# EAGLE design Automaton_no_switches (EAGLE 6.1)
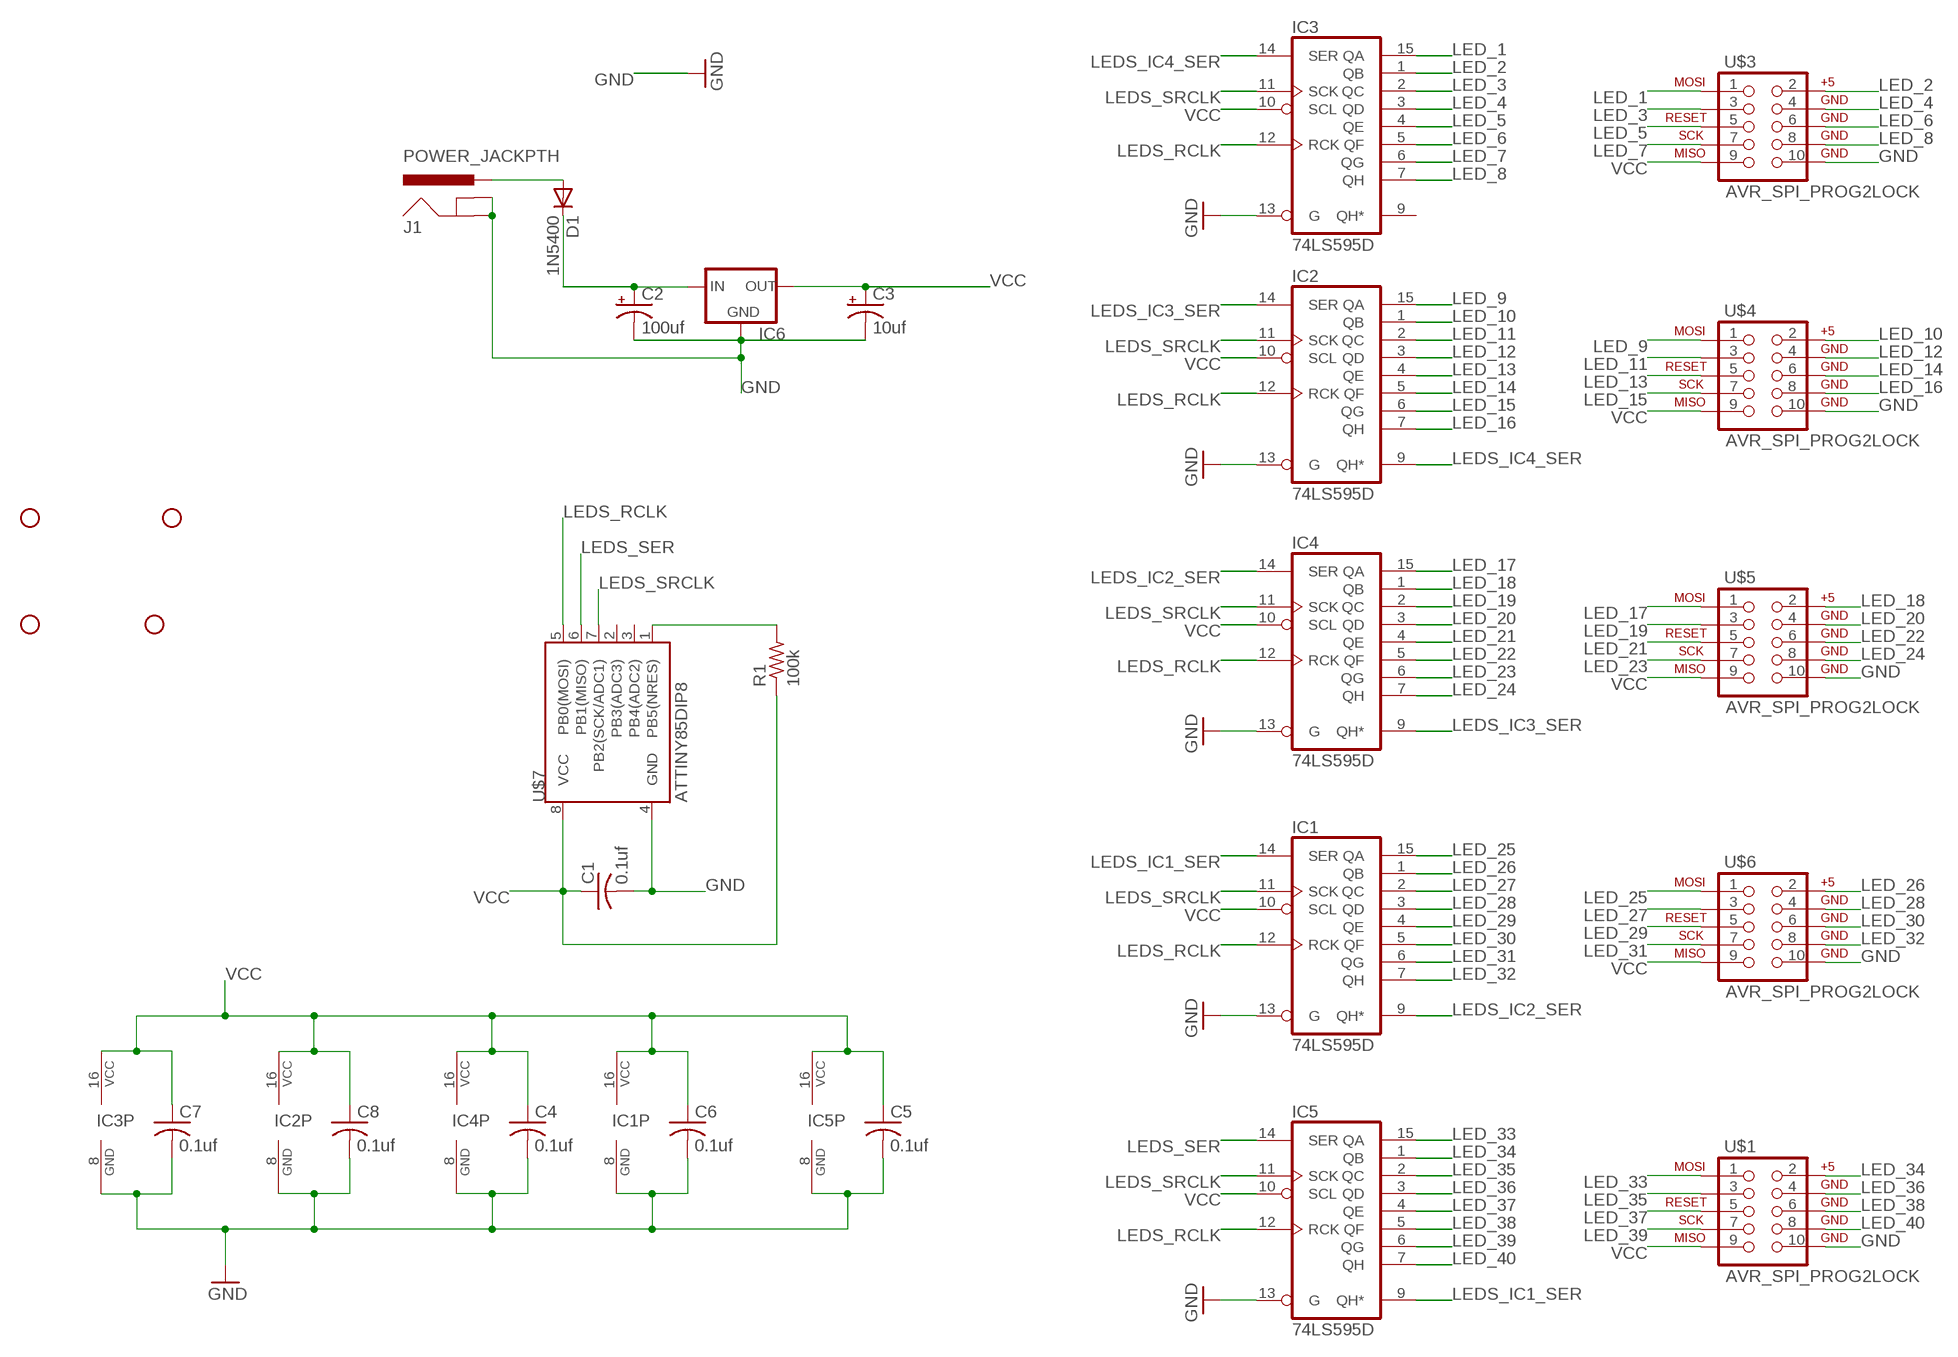
[diagram p0: schematic, sheet 1]

## Parts
C1  0.1uf  C-USC1206  [C1206]
C2  100uf  CPOL-USE5-10.5  [E5-10,5]
C3  10uf  CPOL-USE2-5  [E2-5]
C4  0.1uf  C-USC1206  [C1206]
C5  0.1uf  C-USC1206  [C1206]
C6  0.1uf  C-USC1206  [C1206]
C7  0.1uf  C-USC1206  [C1206]
C8  0.1uf  C-USC1206  [C1206]
D1  1N5400  [DO201-15]
IC1  74LS595D  [SO16]
IC2  74LS595D  [SO16]
IC3  74LS595D  [SO16]
IC4  74LS595D  [SO16]
IC5  74LS595D  [SO16]
IC6  V_REG_78XXSINK  [TO220-IGO]
J1  POWER_JACKPTH  [POWER_JACK_PTH]
JP1  STAND-OFF  [STAND-OFF]
JP2  STAND-OFF  [STAND-OFF]
JP3  STAND-OFF  [STAND-OFF]
JP4  STAND-OFF  [STAND-OFF]
R1  100k  R-US_M1206  [M1206]
U$1  AVR_SPI_PROG2LOCK  [2X5-SHROUDED_LOCK]
U$3  AVR_SPI_PROG2LOCK  [2X5-SHROUDED_LOCK]
U$4  AVR_SPI_PROG2LOCK  [2X5-SHROUDED_LOCK]
U$5  AVR_SPI_PROG2LOCK  [2X5-SHROUDED_LOCK]
U$6  AVR_SPI_PROG2LOCK  [2X5-SHROUDED_LOCK]
U$7  ATTINY85DIP8  [DIP08]

## Nets
GND: C1.2 C2.- C3.- C4.2 C5.2 C6.2 C7.2 C8.2 IC1.8(GND) IC1.13(G) IC2.8(GND) IC2.13(G) IC3.8(GND) IC3.13(G) IC4.8(GND) IC4.13(G) IC5.8(GND) IC5.13(G) IC6.GND J1.GND J1.GNDBREAK U$1.10 U$3.10 U$4.10 U$5.10 U$6.10 U$7.4(GND)
LED_1: IC3.15(QA) U$3.1
LED_2: IC3.1(QB) U$3.2
LED_3: IC3.2(QC) U$3.3
LED_4: IC3.3(QD) U$3.4
LED_5: IC3.4(QE) U$3.5
LED_6: IC3.5(QF) U$3.6
LED_7: IC3.6(QG) U$3.7
LED_8: IC3.7(QH) U$3.8
LED_9: IC2.15(QA) U$4.1
LED_10: IC2.1(QB) U$4.2
LED_11: IC2.2(QC) U$4.3
LED_12: IC2.3(QD) U$4.4
LED_13: IC2.4(QE) U$4.5
LED_14: IC2.5(QF) U$4.6
LED_15: IC2.6(QG) U$4.7
LED_16: IC2.7(QH) U$4.8
LED_17: IC4.15(QA) U$5.1
LED_18: IC4.1(QB) U$5.2
LED_19: IC4.2(QC) U$5.3
LED_20: IC4.3(QD) U$5.4
LED_21: IC4.4(QE) U$5.5
LED_22: IC4.5(QF) U$5.6
LED_23: IC4.6(QG) U$5.7
LED_24: IC4.7(QH) U$5.8
LED_25: IC1.15(QA) U$6.1
LED_26: IC1.1(QB) U$6.2
LED_27: IC1.2(QC) U$6.3
LED_28: IC1.3(QD) U$6.4
LED_29: IC1.4(QE) U$6.5
LED_30: IC1.5(QF) U$6.6
LED_31: IC1.6(QG) U$6.7
LED_32: IC1.7(QH) U$6.8
LED_33: IC5.15(QA) U$1.1
LED_34: IC5.1(QB) U$1.2
LED_35: IC5.2(QC) U$1.3
LED_36: IC5.3(QD) U$1.4
LED_37: IC5.4(QE) U$1.5
LED_38: IC5.5(QF) U$1.6
LED_39: IC5.6(QG) U$1.7
LED_40: IC5.7(QH) U$1.8
LEDS_IC1_SER: IC1.14(SER) IC5.9(QH*)
LEDS_IC2_SER: IC1.9(QH*) IC4.14(SER)
LEDS_IC3_SER: IC2.14(SER) IC4.9(QH*)
LEDS_IC4_SER: IC2.9(QH*) IC3.14(SER)
LEDS_RCLK: IC1.12(RCK) IC2.12(RCK) IC3.12(RCK) IC4.12(RCK) IC5.12(RCK) U$7.5(PB0(MOSI))
LEDS_SER: IC5.14(SER) U$7.6(PB1(MISO))
LEDS_SRCLK: IC1.11(SCK) IC2.11(SCK) IC3.11(SCK) IC4.11(SCK) IC5.11(SCK) U$7.7(PB2(SCK/ADC1))
N$1: C2.+ D1.C IC6.IN
N$2: R1.2 U$7.1(PB5(NRES))
N$3: D1.A J1.PWR
VCC: C1.1 C3.+ C4.1 C5.1 C6.1 C7.1 C8.1 IC1.10(SCL) IC1.16(VCC) IC2.10(SCL) IC2.16(VCC) IC3.10(SCL) IC3.16(VCC) IC4.10(SCL) IC4.16(VCC) IC5.10(SCL) IC5.16(VCC) IC6.OUT R1.1 U$1.9 U$3.9 U$4.9 U$5.9 U$6.9 U$7.8(VCC)
Unconnected: IC3.9(QH*) U$7.2(PB3(ADC3)) U$7.3(PB4(ADC2))

## Library data of the parts
C1 C4-C8 = resistor:C-US: CAPACITOR, American symbol
C2 C3 = rcl:CPOL-US: POLARIZED CAPACITOR, American symbol
D1 = diode:1N5400: DIODE standard rectifier, 3 A, 50 V (Motorola)
IC1-IC5 = 74xx-us:74*595: 8-bit SHIFT REGISTER, output latch
IC6 = SparkFun-PowerIC:V_REG_78XX: Voltage Regulator Standard 7805 5V regulator. IGO (Input Ground Output). Spark Fun Electronics SKU : COM-00107
J1 = SparkFun:POWER_JACK: Power Jack This is the standard 5.5mm barrel jack for power. The PTH is the most common, proven, reliable, footprint. All others are experimental. The Slot footprint only works if the mill layer is transmitted to the PCB fab house so be warned. Spark Fun Electronics SKU : PRT-00119. Mating wall wart : TOL-00298 (and others)
JP1-JP4 = SparkFun-Electromechanical:STAND-OFF: #4 Stand Off This is the mechanical footprint for a #4 phillips button head screw. Use the keepout ring to avoid running the screw head into surrounding components. SKU : PRT-00447
R1 = resistor:R-US_: RESISTOR, American symbol
U$1 U$3-U$6 = SparkFun:AVR_SPI_PROG2: AVR ICSP Header This is the standard AVR In Circuit Serial Programming header. Minimal, but includes pin one indicator. Works with standard Olimex programmers. Also look for the 6-pin reduced version. Spark Fun Electronics SKU: PRT-00778
U$7 = *Personal Library:ATTINY85: Atmel 8-pin 2/4/8kB flash uC

## Board
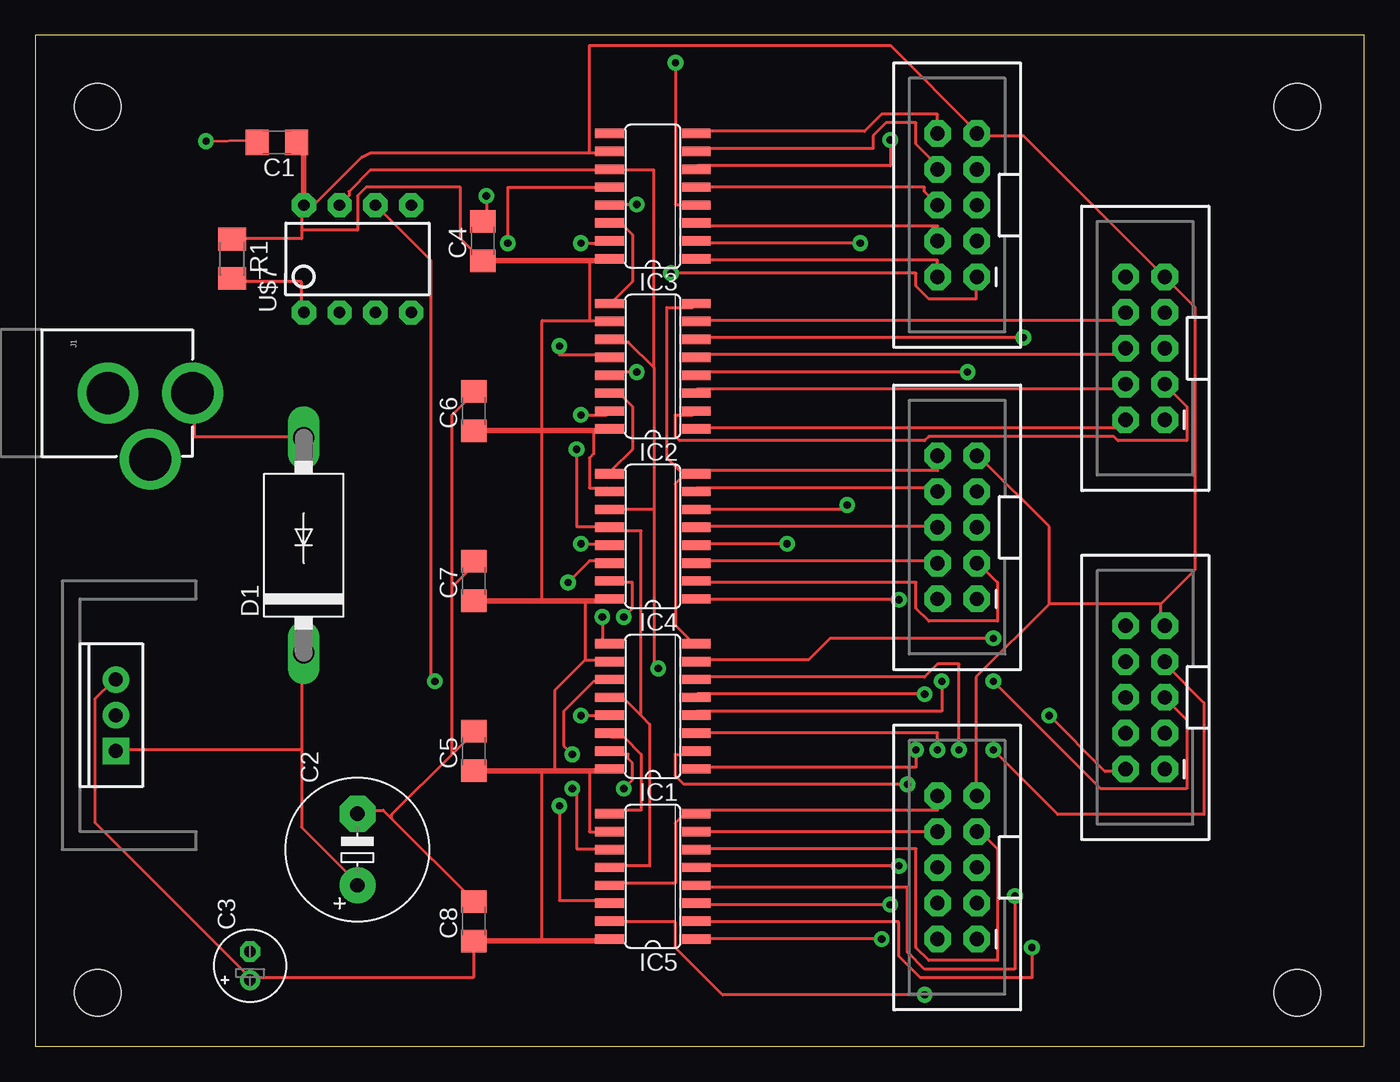
[diagram p1: board, top side]
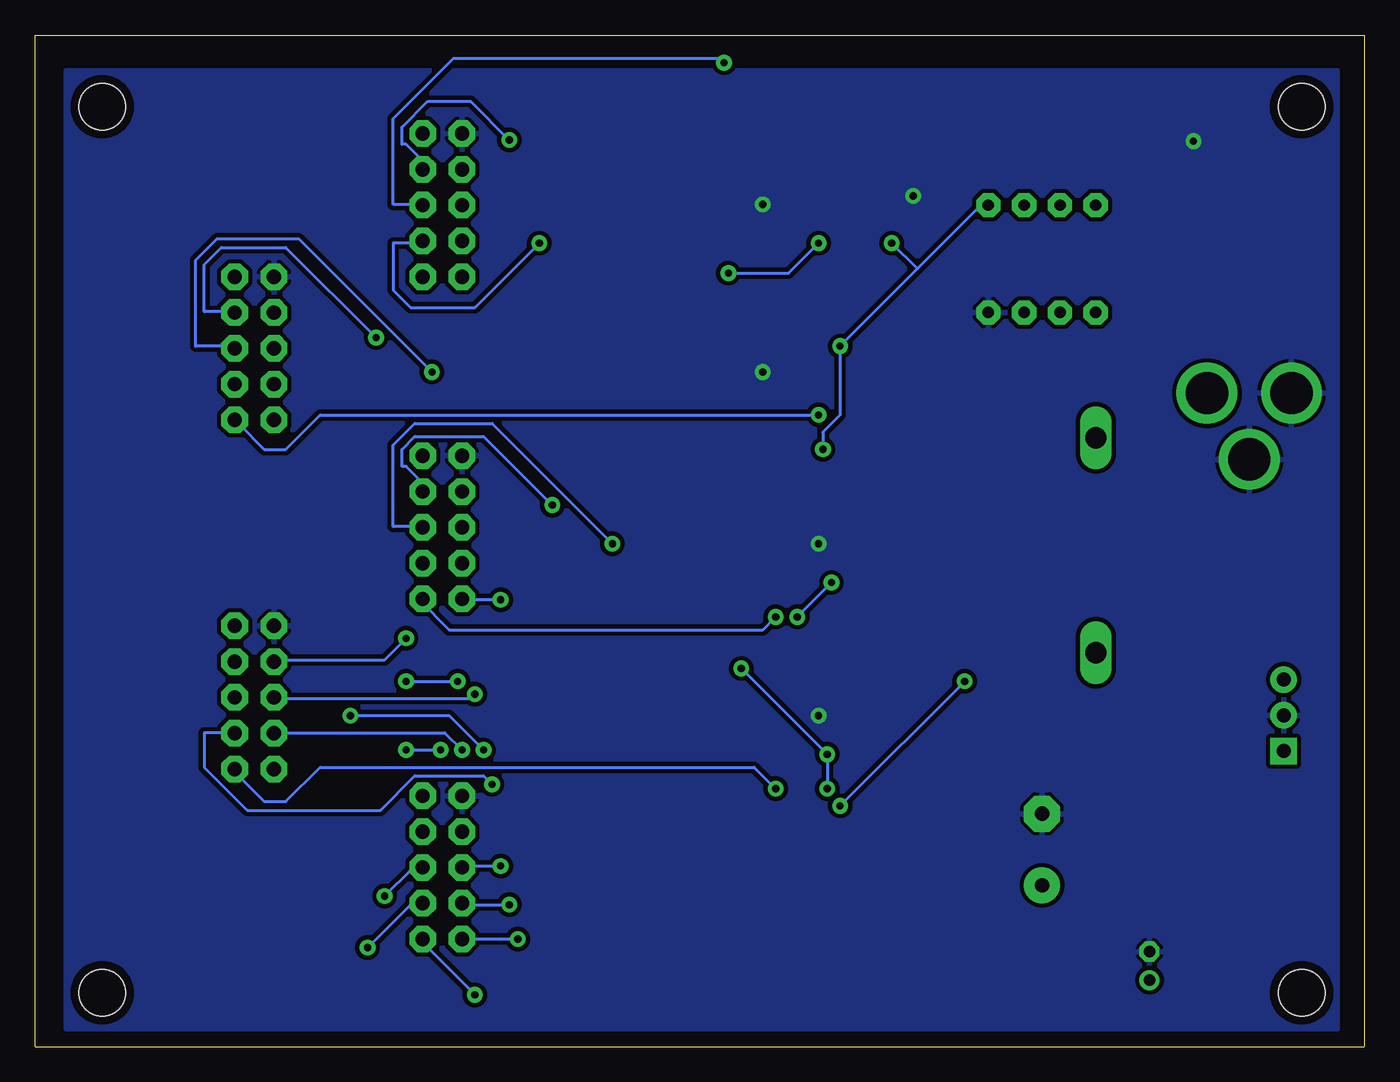
[diagram p2: board, bottom side, seen from below]

Size 94.28 x 71.76 mm. Coordinates in mm from the lower left corner, seen from the top.
Outline: 94.28,0.01 94.28,71.76 0,71.76 0,0.01
Outline: 94.28,0 0,0
Copper layers (1*16): Top 0.035mm / dielectric 1.5mm / Bottom 0.035mm
Design rules: minimum track width 8mil, minimum drill 20mil, track to track 12mil, track to pad 12mil, pad to pad 12mil, via to via 12mil, smd to smd 10mil, copper to edge 12mil, drill to drill 12mil, minimum pad ring 12mil, minimum via ring 12mil, stop-mask expansion 4mil, vias tented up to drill 25mil, thermal gap 10mil

### Footprints (pad centres in the part's own frame; a part is rotated, then mirrored left to right if it is on the bottom)
C1206 = smd 1.6 x 1.8: 1 -1.4,0; 2 1.4,0
E5-10,5 = drill 1.016 pad 2.54: + -2.54,0 | drill 1.016 pad 2.54 octagon: - 2.54,0
E2-5 = drill 0.813 pad 1.27: + -1.016,0 | drill 0.813 pad 1.27 octagon: - 1.016,0
DO201-15 = drill 1.499 long: A 7.62,0; C -7.62,0
SO16 = smd 0.66 x 2.032: 1 -4.445,-3.073; 2 -3.175,-3.073; 3 -1.905,-3.073; 4 -0.635,-3.073; 5 0.635,-3.073; 6 1.905,-3.073; 7 3.175,-3.073; 8 4.445,-3.073; 9 4.445,3.073; 10 3.175,3.073; 11 1.905,3.073; 12 0.635,3.073; 13 -0.635,3.073; 14 -1.905,3.073; 15 -3.175,3.073; 16 -4.445,3.073
TO220-IGO = drill 1 pad 1.88: GND 0,0; OUT 2.54,0 | drill 1 pad 1.88 square: IN -2.54,0
POWER_JACK_PTH = drill 2.997 pad 4.318: GND 0,7.7; GNDBREAK 4.7,10.7; PWR 0,13.7
STAND-OFF = hole 3.302: 0,0
M1206 = smd 1.6 x 2: 1 -1.4,0; 2 1.4,0
2X5-SHROUDED_LOCK = drill 1.016 pad 1.88 octagon: 1 -1.397,5.08; 2 1.397,5.08; 3 -1.397,2.54; 4 1.397,2.54; 5 -1.397,0; 6 1.397,0; 7 -1.397,-2.54; 8 1.397,-2.54; 9 -1.397,-5.08; 10 1.397,-5.08
DIP08 = drill 0.813 pad 1.727 octagon: 1 -3.81,-3.81; 2 -1.27,-3.81; 3 1.27,-3.81; 4 3.81,-3.81; 5 3.81,3.81; 6 1.27,3.81; 7 -1.27,3.81; 8 -3.81,3.81

### Placement (x,y rotation side)
C1  17.14,64.15 180 top
C2  22.86,13.98 90 top
C3  15.24,5.72 90 top
C4  31.75,57.16 90 top
C5  31.11,20.96 90 top
C6  31.11,45.09 90 top
C7  31.11,33.03 90 top
C8  31.11,8.9 90 top
D1  19.05,35.57 90 top
IC1  43.81,24.14 90 top
IC2  43.81,48.27 90 top
IC3  43.81,60.34 90 top
IC4  43.81,36.2 90 top
IC5  43.81,12.07 90 top
IC6  5.71,23.51 90 top
J1  -2.54,46.36 270 top
JP1  4.45,3.82 0 top
JP2  4.45,66.69 0 top
JP3  89.53,3.82 0 top
JP4  89.53,66.69 0 top
R1  13.97,55.89 270 top
U$1  65.41,12.71 180 top
U$3  65.41,59.7 180 top
U$4  78.74,49.54 180 top
U$5  65.41,36.84 180 top
U$6  78.74,24.78 180 top
U$7  22.86,55.89 0 top

### Tracks (layer width: path | path; a pad name or v marks a point on that pad's centre or on a via)
GND  (via drill 0.51)
  Top 0.203: 46.02,40.55 45.41,39.94 45.41,29.88 46.63,28.66 IC1.8 | 46.02,40.55 46.63,40.55 IC4.8 | 46.02,40.55 44.81,41.77 44.81,52.44 46.63,52.44 IC2.8 | 46.02,40.55 IC4.8 | IC5.13 40.84,11.59 45.41,11.59 45.41,15.86 46.02,16.47 46.63,16.47 IC5.8 46.94,16.77 64.01,16.77 U$1.10 | 25.3,16.16 24.69,16.77 22.86,16.77 C2.- | 25.3,16.16 31.09,10.37 C8.2 | 29.57,20.74 25.3,16.47 25.3,16.16 | 29.57,20.74 31.09,22.26 C5.2 | 29.57,32.62 31.09,34.15 C7.2 | 29.57,20.74 29.57,32.62 | 29.57,32.62 29.57,44.82 31.09,46.34 C6.2 | v32,60.36 32,58.84 C4.2 | v12.12,64.25 15.29,64.32 C1.2 | v38.71,23.48 40.54,23.48 IC1.13 | v38.71,35.67 40.54,35.67 IC4.13 | v42.67,47.86 40.84,47.86 IC2.13 | v42.67,59.75 40.84,59.75 IC3.13 | U$3.10 64.01,66.15 60.05,66.15 58.83,64.93 46.94,64.93 IC3.8 | U$5.10 64.01,40.85 46.94,40.85 IC4.8
  pour Bottom (isolate 0.305): 92.08,69.23 1.91,69.23 1.91,1.28 92.08,1.28
LED_1  (via drill 0.51)
  Top 0.203: v38.71,57.01 40.54,57.01 IC3.15 | v45.11,54.87 62.48,54.87 62.48,53.96 63.4,53.04 66.75,53.04 66.75,54.57 U$3.1
  Bottom 0.203: v38.71,57.01 40.84,54.87 v45.11,54.87
LED_2
  Top 0.203: U$3.2 64.01,55.79 46.94,55.79 IC3.1
LED_3  (via drill 0.51)
  Top 0.203: v58.52,57.01 46.94,57.01 IC3.2
  Bottom 0.203: v58.52,57.01 63.09,52.44 67.67,52.44 68.89,53.66 68.89,57.01 67.06,57.01 U$3.3
LED_4
  Top 0.203: U$3.4 64.01,58.23 46.94,58.23 IC3.3
LED_5  (via drill 0.51)
  Top 0.203: v45.41,69.81 45.41,59.75 46.63,59.75 IC3.4
  Bottom 0.203: v45.41,69.81 45.72,70.11 64.62,70.11 68.89,65.85 68.89,59.75 67.06,59.75 U$3.5
LED_6
  Top 0.203: IC3.5 63.09,60.97 63.09,60.66 64.01,59.75 U$3.6
LED_7  (via drill 0.51)
  Top 0.203: v60.66,64.32 60.66,62.49 46.94,62.49 IC3.6
  Bottom 0.203: v60.66,64.32 63.4,67.07 66.45,67.07 68.28,65.24 68.28,64.02 67.97,64.02 67.06,63.1 67.06,62.49 U$3.7
LED_8
  Top 0.203: IC3.7 46.94,63.71 59.44,63.71 59.44,64.63 60.35,65.54 62.48,65.54 62.48,64.02 64.01,62.49 U$3.8
LED_9  (via drill 0.51)
  Top 0.203: v38.71,44.82 40.54,44.82 IC2.15
  Bottom 0.203: v38.71,44.82 74.07,44.82 76.5,42.38 78.03,42.38 79.86,44.21 U$4.1
LED_10
  Top 0.203: IC2.1 46.94,43.9 77.11,43.9 77.11,44.21 U$4.2
LED_11
  Top 0.203: IC2.2 46.63,44.82 45.41,44.82 45.41,43.29 45.72,42.99 63.09,42.99 63.4,43.29 76.5,43.29 76.81,42.99 81.69,42.99 81.69,45.42 80.16,46.95 U$4.3
LED_12
  Top 0.203: IC2.3 46.94,46.64 77.11,46.64 77.11,46.95 U$4.4
LED_13  (via drill 0.51)
  Top 0.203: v66.14,47.86 46.94,47.86 IC2.4
  Bottom 0.203: v66.14,47.86 75.59,57.31 81.38,57.31 82.91,55.79 82.91,49.69 80.16,49.69 U$4.5
LED_14
  Top 0.203: IC2.5 46.94,49.08 77.11,49.08 77.11,49.39 U$4.6
LED_15  (via drill 0.51)
  Top 0.203: v70.1,50.3 46.94,50.3 IC2.6
  Bottom 0.203: v70.1,50.3 76.5,56.7 81.08,56.7 82.3,55.48 82.3,52.13 80.16,52.13 U$4.7
LED_16
  Top 0.203: IC2.7 46.94,51.52 77.11,51.52 77.11,51.83 U$4.8
LED_17  (via drill 0.51)
  Top 0.203: v41.76,30.49 42.37,31.1 42.37,32.93 40.84,32.93 IC4.15
  Bottom 0.203: v41.76,30.49 42.67,29.58 64.92,29.58 67.06,31.71 U$5.1
LED_18  (via drill 0.51)
  Top 0.203: v61.27,31.71 46.94,31.71 IC4.1
  Bottom 0.203: v61.27,31.71 64.01,31.71 U$5.2
LED_19
  Top 0.203: IC4.2 46.94,32.93 62.48,32.93 62.48,31.1 63.4,30.19 68.28,30.19 68.28,32.93 67.06,34.15 U$5.3
LED_20
  Top 0.203: IC4.3 46.94,34.45 64.01,34.45 U$5.4
LED_21  (via drill 0.51)
  Top 0.203: v53.34,35.67 46.94,35.67 IC4.4
  Bottom 0.203: v53.34,35.67 61.87,44.21 67.36,44.21 68.89,42.68 68.89,36.89 67.06,36.89 U$5.5
LED_22
  Top 0.203: IC4.5 46.94,36.89 64.01,36.89 U$5.6
LED_23  (via drill 0.51)
  Top 0.203: IC4.6 57.61,38.11 v57.61,38.41
  Bottom 0.203: v57.61,38.41 62.48,43.29 67.36,43.29 68.28,42.38 68.28,41.16 67.97,41.16 67.06,40.24 67.06,39.63 U$5.7
LED_24
  Top 0.203: IC4.7 46.94,39.63 64.01,39.63 U$5.8
LED_25  (via drill 0.51)
  Top 0.203: v41.76,18.3 42.37,18.91 42.37,20.13 42.06,20.43 42.06,20.74 40.84,20.74 IC1.15
  Bottom 0.203: v41.76,18.3 43.28,19.82 74.07,19.82 76.5,17.38 78.03,17.38 80.16,19.52 U$6.1
LED_26  (via drill 0.51)
  Top 0.203: v62.48,21.04 62.48,19.82 46.94,19.82 IC1.1 | v71.93,23.48 75.89,19.52 77.11,19.52 U$6.2
  Bottom 0.203: v62.48,21.04 64.92,23.48 v71.93,23.48
LED_27  (via drill 0.51)
  Top 0.203: v61.87,18.6 46.02,18.6 45.41,19.21 45.41,20.74 46.63,20.74 IC1.2
  Bottom 0.203: v61.87,18.6 62.48,19.21 67.36,19.21 69.8,16.77 79.25,16.77 82.3,19.82 82.3,22.26 80.16,22.26 U$6.3
LED_28  (via drill 0.51)
  Top 0.203: v64.01,21.04 64.01,22.26 46.94,22.26 IC1.3
  Bottom 0.203: v64.01,21.04 65.23,22.26 77.11,22.26 U$6.4
LED_29  (via drill 0.51)
  Top 0.203: v64.31,25.92 64.31,23.78 46.94,23.78 IC1.4 | v67.97,25.92 75.59,18.3 81.69,18.3 81.69,23.18 80.16,24.7 U$6.5
  Bottom 0.203: v67.97,25.92 v64.31,25.92
LED_30  (via drill 0.51)
  Top 0.203: v63.09,25 46.94,25 IC1.5
  Bottom 0.203: v63.09,25 63.4,24.7 77.11,24.7 U$6.6
LED_31  (via drill 0.51)
  Top 0.203: v65.53,21.04 65.53,27.14 64.01,27.14 63.09,26.22 46.94,26.22 IC1.6 | v67.97,21.04 72.54,16.47 82.91,16.47 82.91,24.39 80.16,27.14 U$6.7
  Bottom 0.203: v67.97,21.04 v65.53,21.04
LED_32  (via drill 0.51)
  Top 0.203: v67.97,28.97 56.39,28.97 54.86,27.44 46.94,27.44 IC1.7
  Bottom 0.203: v67.97,28.97 69.49,27.44 77.11,27.44 U$6.8
LED_33  (via drill 0.51)
  Top 0.203: v63.09,3.67 48.77,3.67 45.41,7.02 45.41,8.85 40.84,8.85 IC5.15
  Bottom 0.203: v63.09,3.67 67.06,7.63 U$1.1
LED_34  (via drill 0.51)
  Top 0.203: v60.05,7.63 IC5.1
  Bottom 0.203: U$1.2 v60.05,7.63
LED_35  (via drill 0.51)
  Top 0.203: v70.71,7.02 70.71,4.89 62.79,4.89 61.27,6.41 61.27,8.85 46.94,8.85 IC5.2
  Bottom 0.203: v70.71,7.02 67.67,10.07 67.06,10.07 U$1.3
LED_36  (via drill 0.51)
  Top 0.203: v60.66,10.07 46.94,10.07 IC5.3
  Bottom 0.203: v60.66,10.07 64.01,10.07 U$1.4
LED_37  (via drill 0.51)
  Top 0.203: v69.49,10.68 69.49,5.5 63.09,5.5 61.87,6.72 61.87,11.29 46.94,11.29 IC5.4
  Bottom 0.203: v69.49,10.68 67.67,12.51 67.06,12.51 U$1.5
LED_38  (via drill 0.51)
  Top 0.203: v61.27,12.81 46.94,12.81 IC5.5
  Bottom 0.203: v61.27,12.81 64.01,12.81 U$1.6
LED_39
  Top 0.203: IC5.6 46.94,14.03 62.48,14.03 62.48,7.02 63.4,6.11 68.28,6.11 68.28,14.03 67.06,15.25 U$1.7
LED_40
  Top 0.203: U$1.8 IC5.7
LEDS_IC1_SER
  Top 0.203: IC5.9 40.84,16.77 42.98,16.77 42.98,20.74 41.76,21.96 40.84,21.96 IC1.14
LEDS_IC2_SER  (via drill 0.51)
  Top 0.203: v40.23,30.49 40.23,28.97 40.54,28.66 IC1.9 | v37.8,32.93 39.32,34.45 40.54,34.45 IC4.14
  Bottom 0.203: v37.8,32.93 v40.23,30.49
LEDS_IC3_SER
  Top 0.203: IC4.9 40.84,40.85 42.37,42.38 42.37,45.42 41.45,46.34 40.84,46.34 IC2.14
LEDS_IC4_SER
  Top 0.203: IC2.9 40.84,52.74 42.37,54.26 42.37,57.62 41.76,58.23 40.84,58.23 IC3.14
LEDS_RCLK  (via drill 0.51)
  Top 0.203: 42.98,23.48 41.76,24.7 40.84,24.7 IC1.12 | 42.98,23.48 43.59,22.87 43.59,12.81 40.84,12.81 IC5.12 | 42.98,23.48 42.98,36.59 40.84,36.59 IC4.12 40.54,36.89 38.41,36.89 v38.41,42.38 | v37.19,49.69 37.19,49.08 40.54,49.08 IC2.12 | IC3.12 33.53,60.97 v33.53,57.01
  Bottom 0.203: 31.7,55.18 27.43,59.45 26.82,59.45 U$7.5 | 31.7,55.18 v37.19,49.69 37.19,44.82 38.41,43.6 v38.41,42.38 | 31.7,55.18 v33.53,57.01
LEDS_SER  (via drill 0.51)
  Top 0.203: v37.19,17.08 37.19,10.37 40.54,10.37 IC5.14 | v28.35,25.92 28.04,26.22 28.04,55.79 U$7.6
  Bottom 0.203: v28.35,25.92 v37.19,17.08
LEDS_SRCLK  (via drill 0.51)
  Top 0.203: v38.1,18.3 38.41,17.99 38.41,14.03 40.54,14.03 IC5.11 | v38.1,20.74 37.49,21.35 37.49,23.78 39.62,25.92 40.54,25.92 IC1.11 | 43.89,38.11 IC4.11 | 43.89,48.17 43.89,38.11 | 43.89,48.17 42.06,50 40.84,50 IC2.11 | 43.89,48.17 43.89,62.19 40.84,62.19 IC3.11 40.54,62.19 23.77,62.19 22.25,60.66 22.25,60.36 U$7.7 | v44.2,26.83 43.89,27.14 43.89,38.11
  Bottom 0.203: v38.1,18.3 v38.1,20.74 v44.2,26.83
N$1
  Top 0.203: 18.9,21.04 5.79,21.04 IC6.IN | 18.9,21.04 18.9,27.75 D1.C | 18.9,21.04 18.9,15.55 22.86,11.59 C2.+
N$2
  Top 0.203: R1.2 14.02,54.26 18.9,54.26 18.9,52.13 U$7.1
N$3
  Top 0.203: D1.A 18.9,43.29 11.28,43.29 11.28,46.34 J1.PWR
VCC
  Top 0.203: 71.93,31.4 66.75,26.22 66.75,17.99 U$1.9 | 79.86,31.4 71.93,31.4 | 79.86,31.4 79.86,29.88 U$6.9 | 71.93,31.4 71.93,36.89 67.06,41.77 U$5.9 | 79.86,31.4 82.3,33.84 82.3,52.44 80.16,54.57 U$4.9 79.86,54.87 70.1,64.63 67.06,64.63 U$3.9 66.75,64.93 60.66,71.03 39.32,71.03 39.32,63.41 | 18.9,58.84 18.9,59.45 U$7.8 | 18.9,58.84 18.9,57.92 | 18.9,57.92 18.9,57.31 14.02,57.31 R1.1 | 39.32,63.41 23.8,63.41 23.16,63.1 18.9,58.84 | 39.32,63.41 40.54,63.41 IC3.10 | 39.32,51.52 40.54,51.52 IC2.10 | 39.32,51.52 39.32,55.76 39.32,55.79 | 39.62,43.7 39.62,42.07 39.32,41.77 39.32,39.63 40.54,39.63 IC4.10 | 39.01,27.44 40.54,27.44 IC1.10 | 39.01,27.44 39.01,31.63 39.01,31.71 | 35.97,31.63 35.97,43.7 35.97,51.52 39.32,51.52 | IC5.10 39.32,15.25 39.32,19.57 | 15.24,4.89 31.09,4.89 31.09,7.33 C8.1 | 35.97,7.5 35.97,19.57 | 15.24,4.89 4.27,15.86 4.27,24.7 5.49,25.92 IC6.OUT | 15.24,4.89 C3.+ | 39.01,27.44 36.88,25.31 36.88,19.57 36.88,19.52 | 18.9,57.92 22.86,57.92 22.86,60.36 23.47,60.97 30.18,60.97 30.18,57.31 31.7,55.79 C4.1
  Top 0.406: C6.1 35.97,43.7 39.62,43.7 40.74,43.7 IC2.16 | C4.1 39.32,55.76 40.74,55.76 IC3.16 | C1.1 19.05,64.15 U$7.8 | C7.1 35.97,31.63 39.01,31.63 40.74,31.63 IC4.16 | C5.1 35.97,19.57 36.88,19.57 39.32,19.57 40.74,19.57 IC1.16 | C8.1 35.97,7.5 40.74,7.5 IC5.16